# Altium schematic sheet Output Drivers.SchDoc
size A4; SheetNumber: 6; SheetTotal: 6
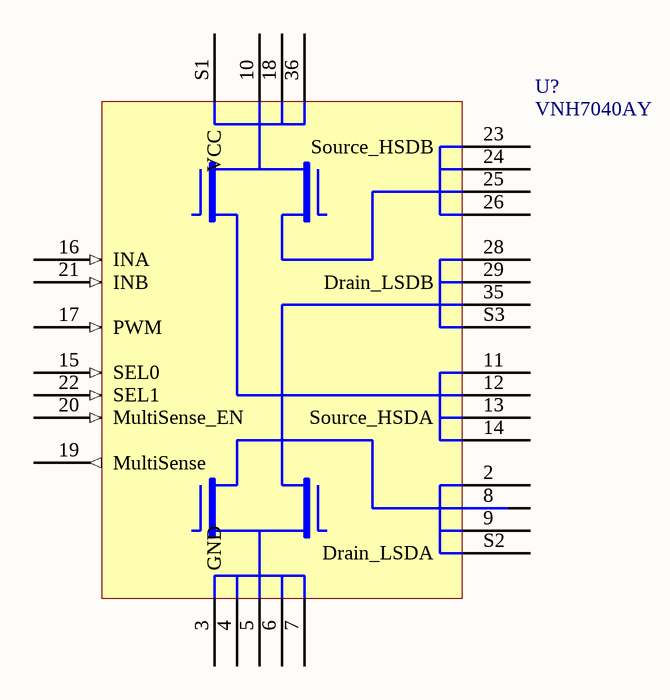
[diagram p0: Output Drivers.SchDoc]

## Parts
U?  VNH7040AY  [ST PowerSSO-36]

## Nets

Not connected (* = marked no-connect by the designer): U? 2(Drain_LSDA) 3(GND) 4(GND) 5(GND) 6(GND) 7(GND) 8(Drain_LSDA) 9(Drain_LSDA) 10(VCC) 11(Source_HSDA) 12(Source_HSDA) 13(Source_HSDA) 14(Source_HSDA) 15(SEL0) 16(INA) 17(PWM) 18(VCC) 19(MultiSense) 20(MultiSense_EN) 21(INB) 22(SEL1) 23(Source_HSDB) 24(Source_HSDB) 25(Source_HSDB) 26(Source_HSDB) 28(Drain_LSDB) 29(Drain_LSDB) 35(Drain_LSDB) 36(VCC) S1(VCC) S2(Drain_LSDA) S3(Drain_LSDB)

## Library data of the parts
U? = VNH7040AY: Motor Driver Power MOSFET PWM PowerSSO-36 TP; Manufacturer: STMicroelectronics; Notes/Alternatives: VNH7070AYTR; Part Number: VNH7040AY; Digikey Part Number: 497-17631-1-ND; Digikey Link: https://www.digikey.com/en/products/detail/stmicroelectronics/VNH7040AYTR/7691019?s=N4IgTCBcDaIG4DsAWB2ADAFjSAugXyA